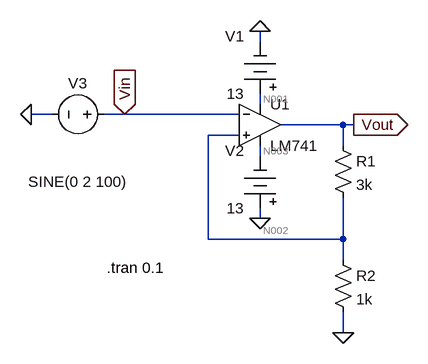
[diagram p0: schematic Draft3.asc]
Draft3.asc, the LTspice schematic file:
Version 4
SHEET 1 1308 680
WIRE 240 16 240 0
WIRE 240 112 240 96
WIRE -80 128 -112 128
WIRE 32 128 0 128
WIRE 208 128 32 128
WIRE 368 144 272 144
WIRE 384 144 368 144
WIRE 208 160 160 160
WIRE 368 176 368 144
WIRE 240 192 240 176
WIRE 240 288 240 272
WIRE 160 320 160 160
WIRE 368 320 368 256
WIRE 368 320 160 320
WIRE 368 352 368 320
WIRE 368 464 368 432
FLAG 240 288 0
FLAG 240 0 0
FLAG -112 128 0
FLAG 384 144 Vout
IOPIN 384 144 Out
FLAG 32 128 Vin
IOPIN 32 128 In
FLAG 368 464 0
SYMBOL OpAmps\\LM741 240 80 R0
SYMATTR InstName U1
SYMBOL Misc\\battery 240 112 R180
WINDOW 0 24 104 Left 2
WINDOW 3 24 16 Left 2
WINDOW 123 0 0 Left 0
WINDOW 39 0 0 Left 0
SYMATTR InstName V1
SYMATTR Value 13
SYMBOL Misc\\battery 240 288 R180
WINDOW 0 24 104 Left 2
WINDOW 3 24 16 Left 2
WINDOW 123 0 0 Left 0
WINDOW 39 0 0 Left 0
SYMATTR InstName V2
SYMATTR Value 13
SYMBOL voltage 16 128 R90
WINDOW 0 -32 56 VBottom 2
WINDOW 3 88 56 VTop 2
WINDOW 123 60 56 VTop 2
WINDOW 39 0 0 Left 0
SYMATTR InstName V3
SYMATTR Value SINE(0 2 100)
SYMBOL res 352 336 R0
SYMATTR InstName R2
SYMATTR Value 1k
SYMBOL res 352 160 R0
SYMATTR InstName R1
SYMATTR Value 3k
TEXT 4 364 Left 2 !.tran 0.1

The netlist it stands for:
* Draft3.asc
XU1 N002 Vin N001 N003 Vout LM741  ; pins In+ In- V+ V- OUT
V1 N001 0 13
V2 0 N003 13
V3 Vin 0 SINE(0 2 100)
R2 N002 0 1k
R1 Vout N002 3k
.tran 0.1
.lib LM741.lib
.backanno
.end

* Results of the author's LTspice run, read from the files saved beside the schematic
* Operating Point, zero values left out:
*   V(n002) = -1 mV
*   V(n003) = -13 V
*   V(n001) = 13 V
*   V(vout) = -3.826 mV
*   I(R1) = -942.1 nA
*   I(R2) = -1 µA
*   I(V3) = -101.9 nA
*   I(V2) = -1.652 mA
*   I(V1) = -1.651 mA
*   Ix(u1:1) = 57.86 nA
*   Ix(u1:2) = 101.9 nA
*   Ix(u1:99) = 1.651 mA
*   Ix(u1:50) = -1.652 mA
*   Ix(u1:28) = 942.1 nA
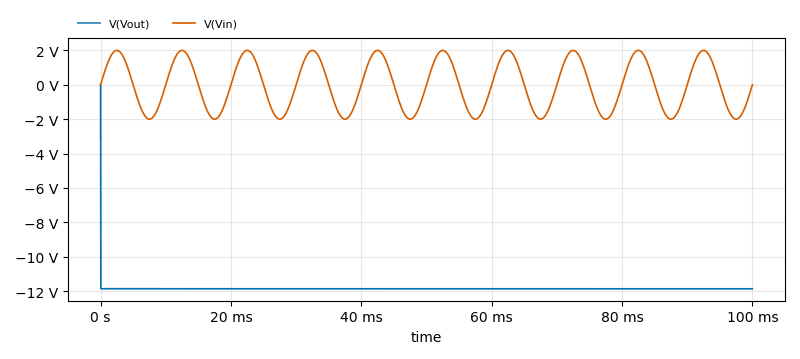
[diagram p1: Transient Analysis of Draft3.asc, plotted from the saved traces]
* Transient Analysis, 1 run:
*   V(Vout): min -11.86 V, max -3.826 mV, average -11.86 V, rms 11.86 V, last -11.86 V
*   V(Vin): min -2 V, max 2 V, average -246.6 µV, rms 1.415 V, last 0 V